# EAGLE design ESP82_Sensor_interface (EAGLE 9.6.2)
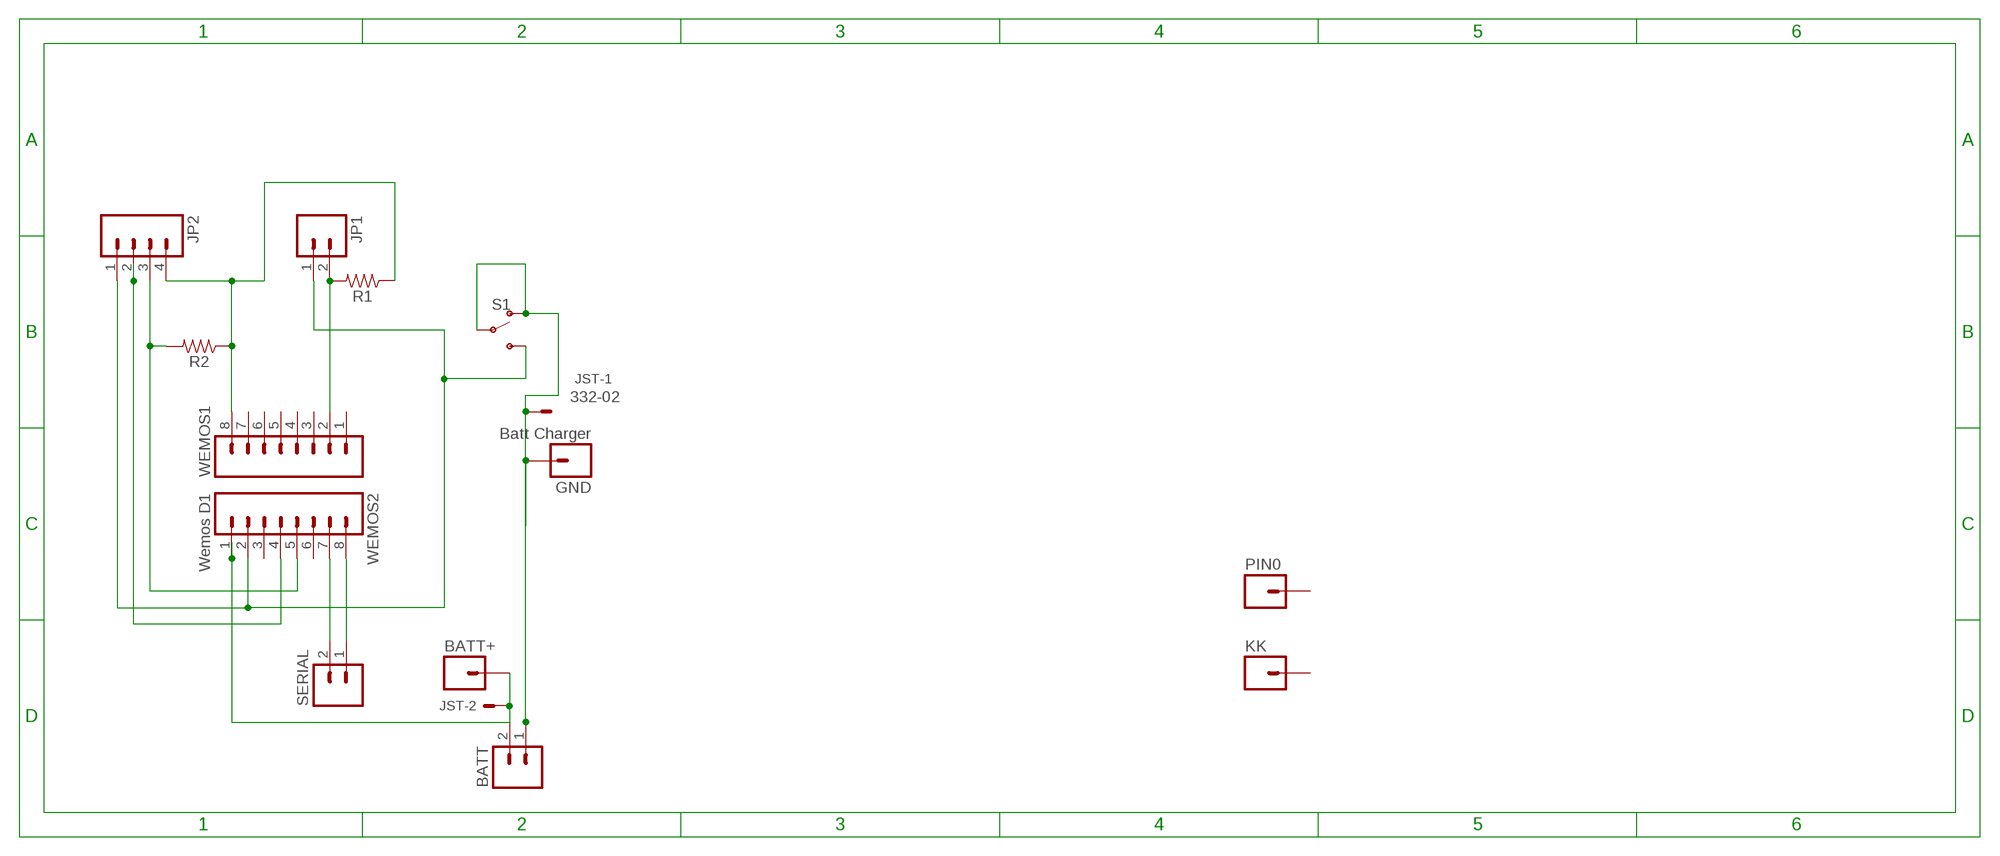
[diagram p0: schematic, sheet 1]

## Parts
BATT  M02LOCK_LONGPADS  [1X02_LOCK_LONGPADS]
BATT+  M01PTH  [1X01]
GND  Batt Charger  M01PTH  [1X01]
JP1  M02PTH  [1X02]
JP2  M04PTH  [1X04]
JST  332-02  [332-02]
KK  M01PTH  [1X01]
PIN0  M01PTH  [1X01]
R1  RESISTOR1206  [1206]
R2  RESISTOR1206  [1206]
S1  SWITCH-SPDT-SMD-RIGHT-ANGLE  [SWITCH_SPST_SMD_A]
SERIAL  M02PTH  [1X02]
WEMOS1  M08  [1X08_ROUND]
WEMOS2  Wemos D1  M08  [1X08_ROUND]

## Nets
3.3V: JP2.4 R1.1 R2.1 WEMOS1.8
5V: BATT+.1 BATT.2 JST.2 WEMOS2.1
A0: JP1.2 R1.2 WEMOS1.2
D2: JP2.3 R2.2 WEMOS2.5
ENTREEGND: BATT.1 GND.1 JST.1 S1.1(O) S1.2(P)
GND: JP1.1 JP2.1 S1.3(S) WEMOS2.2
N$1: JP2.2 WEMOS2.4
RX: SERIAL.2 WEMOS2.7
TX: SERIAL.1 WEMOS2.8
Unconnected: KK.1 PIN0.1 WEMOS1.1 WEMOS1.3 WEMOS1.4 WEMOS1.5 WEMOS1.6 WEMOS1.7 WEMOS2.3 WEMOS2.6

## Library data of the parts
BATT JP1 SERIAL = SparkFun-Connectors:M02: Standard 2-pin 0.1" header. Use with - straight break away headers ( PRT-00116) - right angle break away headers (PRT-00553) - swiss pins (PRT-00743) - machine pins (PRT-00117) - female headers (PRT-00115) Molex polarized connector foot print use with: PRT-08233 with associated crimp pins and housings. 2.54_SCREWTERM for use with PRT-10571. 3.5mm Screw Terminal footprints for PRT-08084 5mm Screw Terminal footprints for use with PRT-08432
BATT+ GND KK PIN0 = SparkFun-Connectors:M01: Header 1 Standard 1-pin 0.1" header. Use with straight break away headers (SKU : PRT-00116), right angle break away headers (PRT-00553), swiss pins (PRT-00743), machine pins (PRT-00117), and female headers (PRT-00115).
JP2 = SparkFun-Connectors:M04: Header 4 Standard 4-pin 0.1" header. Use with straight break away headers (SKU : PRT-00116), right angle break away headers (PRT-00553), swiss pins (PRT-00743), machine pins (PRT-00117), and female headers (PRT-00115). Molex polarized connector foot print use with SKU : PRT-08231 with associated crimp pins and housings. 1MM SMD Version SKU: PRT-10208
JST = con-garry:332-02: 2 Pin - 2mm Dual Row Source: www.mpe-connector.de / garry_shortform_2012.pdf
R1 R2 = SparkFun-Resistors:RESISTOR: Generic Resistor Package
S1 = SparkFun-Switches:SWITCH-SPDT: Single Pole, Double Throw (SPDT) Switch Single-pole, double-throw (SPDT) switch. Variant Overview SMD-AYZ0202 Surface Mount DPDT Switch <https://www.sparkfun.com/products/597> (COM-00597) Used on e.g. LilyPad Arduino USB - ATmega32U4 Board <https://www.sparkfun.com/products/12049> PTH-11.6X4.0MM SPDT Mini Power Switch <https://www.sparkfun.com/products/102> (COM-00102) Used on e.g. SparkFun Simon Says - Through-Hole Soldering Kit <https://www.sparkfun.com/products/10547> (KIT-10547) PTH-11.6X4.0MM-KIT KIT version of SPDT Mini Power Switch - Simplifies soldering by removing tStop of switch pins - only one side can be soldered. PTH-11.6X4.0MM-LOCK LOCK version of SPDT Mini Power Switch - Offset pins hold switch in place for easier soldering. SMD-RIGHT-ANGLE Surface Mount Right Angle Switch <https://www.sparkfun.com/products/10860> (COM-10860) Used on e.g. SparkFun ESP8266 Thing <https://www.sparkfun.com/products/13231>; PROD_ID: SWCH-10651; SF_SKU: COM-10860
WEMOS1 WEMOS2 = SparkFun-Connectors:M08: Header 8 Standard 8-pin 0.1" header. Use with straight break away headers (SKU : PRT-00116), right angle break away headers (PRT-00553), swiss pins (PRT-00743), machine pins (PRT-00117), and female headers (PRT-00115).

## Board
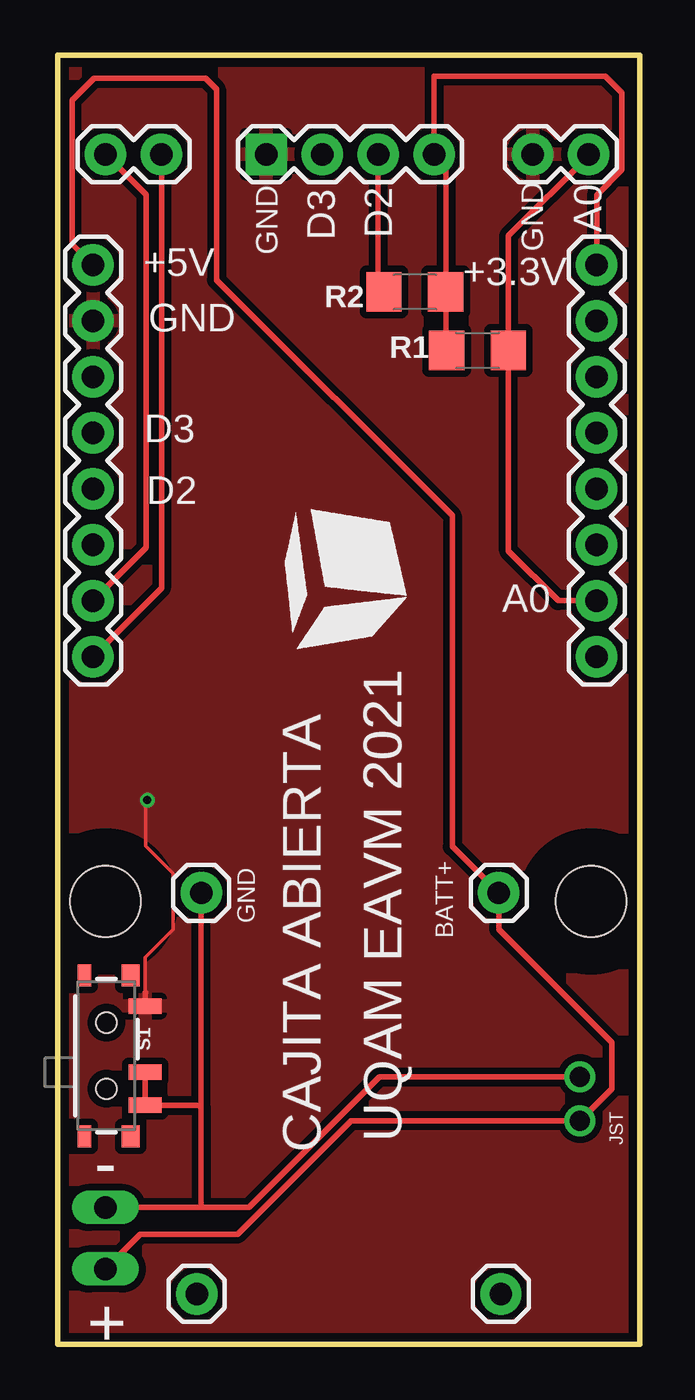
[diagram p1: board, top side]
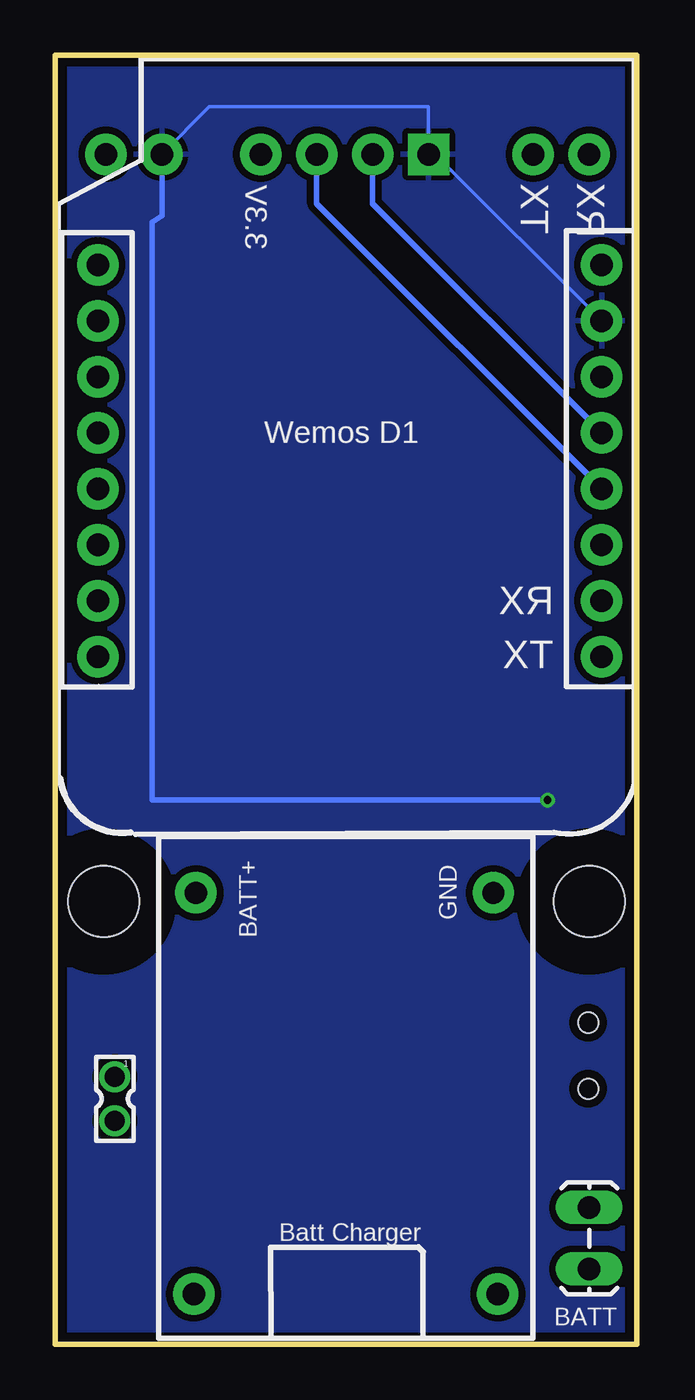
[diagram p2: board, bottom side, seen from below]

Size 26.4 x 58.5 mm. Coordinates in mm from the lower left corner, seen from the top.
Outline: 0,0 0,58.5 26.4,58.5 26.4,0 0,0
Copper layers (1*16): Top 0.035mm / dielectric 1.5mm / Bottom 0.035mm
Design rules "NOA Eagle Rule 2016-06-12": minimum track width 6mil, minimum drill 0.3mm, track to track 6mil, track to pad 6mil, pad to pad 6mil, via to via 6mil, smd to smd 0mil, copper to edge 0.4mm, drill to drill 10mil, minimum pad ring 10mil, minimum via ring 6mil, stop-mask expansion 2mil, vias tented up to drill 25mil, thermal gap 10mil

### Footprints (pad centres in the part's own frame; a part is rotated, then mirrored left to right if it is on the bottom)
1X02_LOCK_LONGPADS = drill 1.016 long: 1 -0.127,0; 2 2.667,0
1X01 = drill 1.016 pad 1.88: 1 0,0
1X02 = drill 1.016 pad 1.88: 1 0,0; 2 2.54,0
1X04 = drill 1.016 pad 1.88 square: 1 0,0 | drill 1.016 pad 1.88: 2 2.54,0; 3 5.08,0; 4 7.62,0
332-02 = drill 0.9 pad 1.27: 1 0,-1; 2 0,1
1206 = smd 1.6 x 1.8: 1 -1.4,0; 2 1.4,0
SWITCH_SPST_SMD_A = smd 0.7 x 1.5: 1 -2.25,-1.75; 2 -0.75,-1.75; 3 2.25,-1.75 | smd 1 x 0.6: GND1 -3.65,1; GND3 3.65,1 | smd 1 x 0.8: GND2 -3.65,-1.1; GND4 3.65,-1.1 | hole 0.9: -1.5,0; 1.5,0
M3-HOLE = hole 3.2: 0,0
1X08_ROUND = drill 1.016 pad 1.88: 1 0,0; 2 2.54,0; 3 5.08,0; 4 7.62,0; 5 10.16,0; 6 12.7,0; 7 15.24,0; 8 17.78,0

### Placement (x,y rotation side)
BATT  2.16,6.09 270 bottom
BATT+  20,20.49 0 top
GND  6.5,20.49 0 top
JP1  21.55,54 0 top
JP2  9.45,54 0 top
JST  23.69,11.15 180 bottom
KK  6.3,2.29 0 top
PIN0  20.1,2.29 0 top
R1  19.05,45.1 0 top
R2  16.2,47.75 180 top
S1  2.2,13.1 90 top
SERIAL  4.7,54 180 top
U$1  [M3-HOLE]  2.15,20.1 0 top
U$2  [M3-HOLE]  24.2,20.1 0 top
WEMOS1  24.45,31.2 90 top
WEMOS2  1.59,48.98 270 top

### Tracks (layer width: path | path; a pad name or v marks a point on that pad's centre or on a via)
3.3V
  Top 0.254: R1.1 17.6,45.15 R2.1 17.6,54 JP2.4 17.07,57.55 24.85,57.55 25.6,56.8 25.6,53.3 24.45,52.15 WEMOS1.8
5V
  Top 0.254: BATT.2 3.73,5 8.15,5 13.29,10.14 JST.2 25.14,11.6 25.14,13.69 20,18.83 BATT+.1 17.9,22.59 17.9,37.6 7.2,48.3 7.2,56.95 6.7,57.45 1.65,57.45 0.65,56.45 0.65,49.92 WEMOS2.1
A0
  Top 0.254: WEMOS1.2 22.7,33.74 20.45,36 R1.2 20.45,50.3 24.09,53.94 JP1.2
D2
  Top 0.254: R2.2 14.65,47.75 14.53,47.75 JP2.3
  Bottom 0.254: WEMOS2.5 14.53,51.76 JP2.3
ENTREEGND
  Top 0.254: 6.5,10.75 GND.1 | BATT.1 6.5,6.22 | 6.5,6.22 8.67,6.22 14.6,12.15 JST.1 | 6.5,10.75 6.5,6.22 | S1.2 S1.1 6.4,10.85 6.5,10.75
GND  (via drill 0.35)
  Top 0.152: S1.3 3.95,17.55 5.23,18.83 5.23,21.37 3.98,22.62 3.98,24.65
  Top 0.254: 3.98,15.97 3.95,15.97 S1.3 | 3.98,24.65 4.05,24.65 v4.05,24.7
  Bottom 0.152: WEMOS2.2 9.15,54 JP2.1 9.45,56.15 19.4,56.15 JP1.1
  Bottom 0.254: JP1.1 21.55,51.21 22,50.93 22,24.7 v4.05,24.7
  pour Top (isolate 0.305): -0.05,58.3 26.37,58.3 26.02,0.39 0.09,0.49
  pour Bottom (isolate 0.305): 0,58.35 26.37,58.35 25.96,0.4 25.76,0.4 25.96,0.3 0.1,0.43
N$1
  Bottom 0.254: WEMOS2.4 11.99,51.76 JP2.2
RX
  Top 0.254: WEMOS2.7 4,36.15 4,52.16 SERIAL.2
TX
  Top 0.254: SERIAL.1 4.7,34.31 WEMOS2.8

### Text on the board
tNames: D3 | D2 | GND | A0 | GND | +5V | +3.3V | GND | D3 | D2 | A0 | CAJITA ABIERTA | UQAM EAVM 2021 | - | +
bNames: RX | TX | 3.3V | RX | TX | BATT+ | GND
uqam: v0.2
noms_b: V+ | 3V3 | G | D4 | D7 | D2 | A0
192bmp: /Users/uqam/Desktop/ohanda_logo.bmp
noms_t: G | DHT11 | D7 | SPKR | 3V | A0 | D2 | G | DEL | V+ | D2 | A0 | D4 | D7 | G | G | V+ | 3V3 | V+ | MQ-7 | V+ | PWR | G
225bmp: /Users/uqam/Documents/AgitPOV_WiFi/logo_texte_gagarin.bmp